# EAGLE design error (EAGLE 6.6.0)
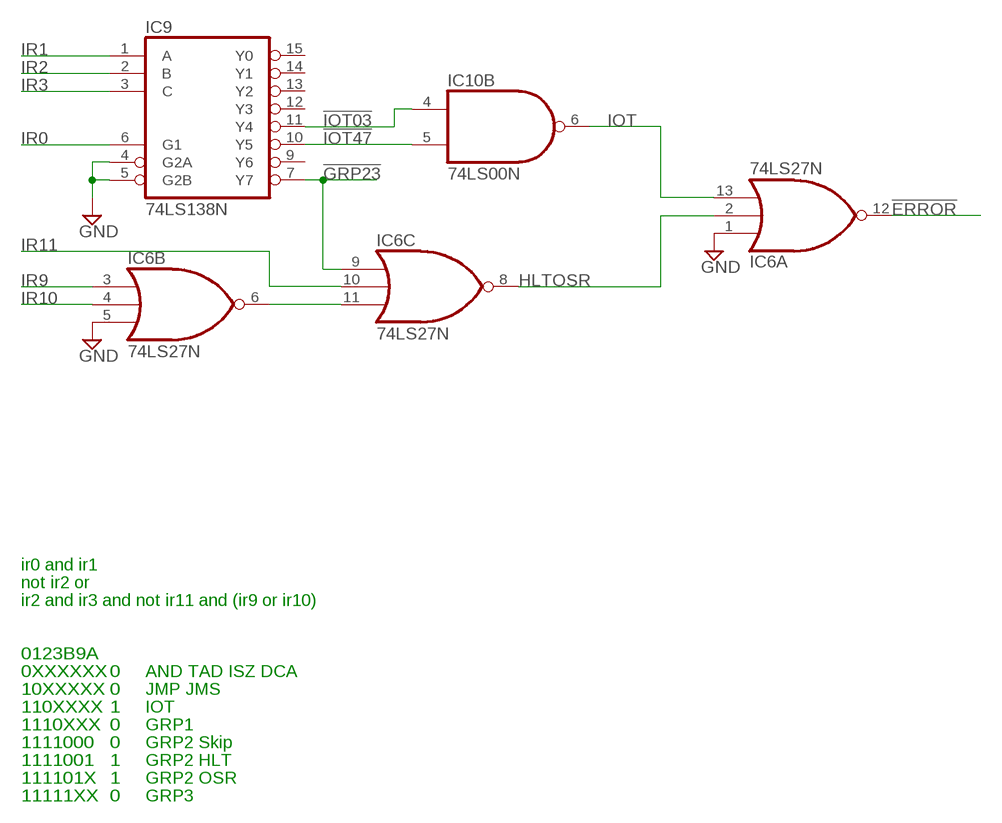
[diagram p0: schematic, sheet 1]

## Parts
IC6  74LS27N  [DIL14]
IC9  74LS138N  [DIL16]
IC10  74LS00N  [DIL14]

## Nets
!ERROR: IC6.12(A:O)
!GRP23: IC6.9(C:I0) IC9.7(Y7)
!IOT03: IC9.11(Y4) IC10.4(B:I0)
!IOT47: IC9.10(Y5) IC10.5(B:I1)
GND: IC6.1(A:I0) IC6.5(B:I2) IC9.4(G2A) IC9.5(G2B)
HLTOSR: IC6.2(A:I1) IC6.8(C:O)
IOT: IC6.13(A:I2) IC10.6(B:O)
IR0: IC9.6(G1)
IR1: IC9.1(A)
IR2: IC9.2(B)
IR3: IC9.3(C)
IR9: IC6.3(B:I0)
IR10: IC6.4(B:I1)
IR11: IC6.10(C:I1)
N$14: IC6.6(B:O) IC6.11(C:I2)
Unconnected: IC9.9(Y6) IC9.12(Y3) IC9.13(Y2) IC9.14(Y1) IC9.15(Y0) IC10.1(A:I0) IC10.2(A:I1) IC10.3(A:O) IC10.8(C:O) IC10.9(C:I0) IC10.10(C:I1) IC10.11(D:O) IC10.12(D:I0) IC10.13(D:I1)

## Notes on the sheet
- ir0 and ir1
- not ir2 or
- ir2 and ir3 and not ir11 and (ir9 or ir10)
- 0123B9A
- 0XXXXXX | 0 | AND TAD ISZ DCA
- 10XXXXX | 0 | JMP JMS
- 110XXXX | 1 | IOT
- 1110XXX | 0 | GRP1
- 1111000 | 0 | GRP2 Skip
- 1111001 | 1 | GRP2 HLT
- 111101X | 1 | GRP2 OSR
- 11111XX | 0 | GRP3

## Power pins joined to a net without a drawn wire
GND: IC6.7(P:GND) IC9.8(GND) IC10.7(P:GND)
VCC: IC6.14(P:VCC) IC9.16(VCC) IC10.14(P:VCC)

## Library data of the parts
IC6 = 74xx-us:74*27: Triple 3-input NOR gate
IC9 = 74xx-us:74*138: 3-line to 8-line DECODER/DEMULTIPLEXER
IC10 = 74xx-us:74*00: Quad 2-input NAND gate

## Board
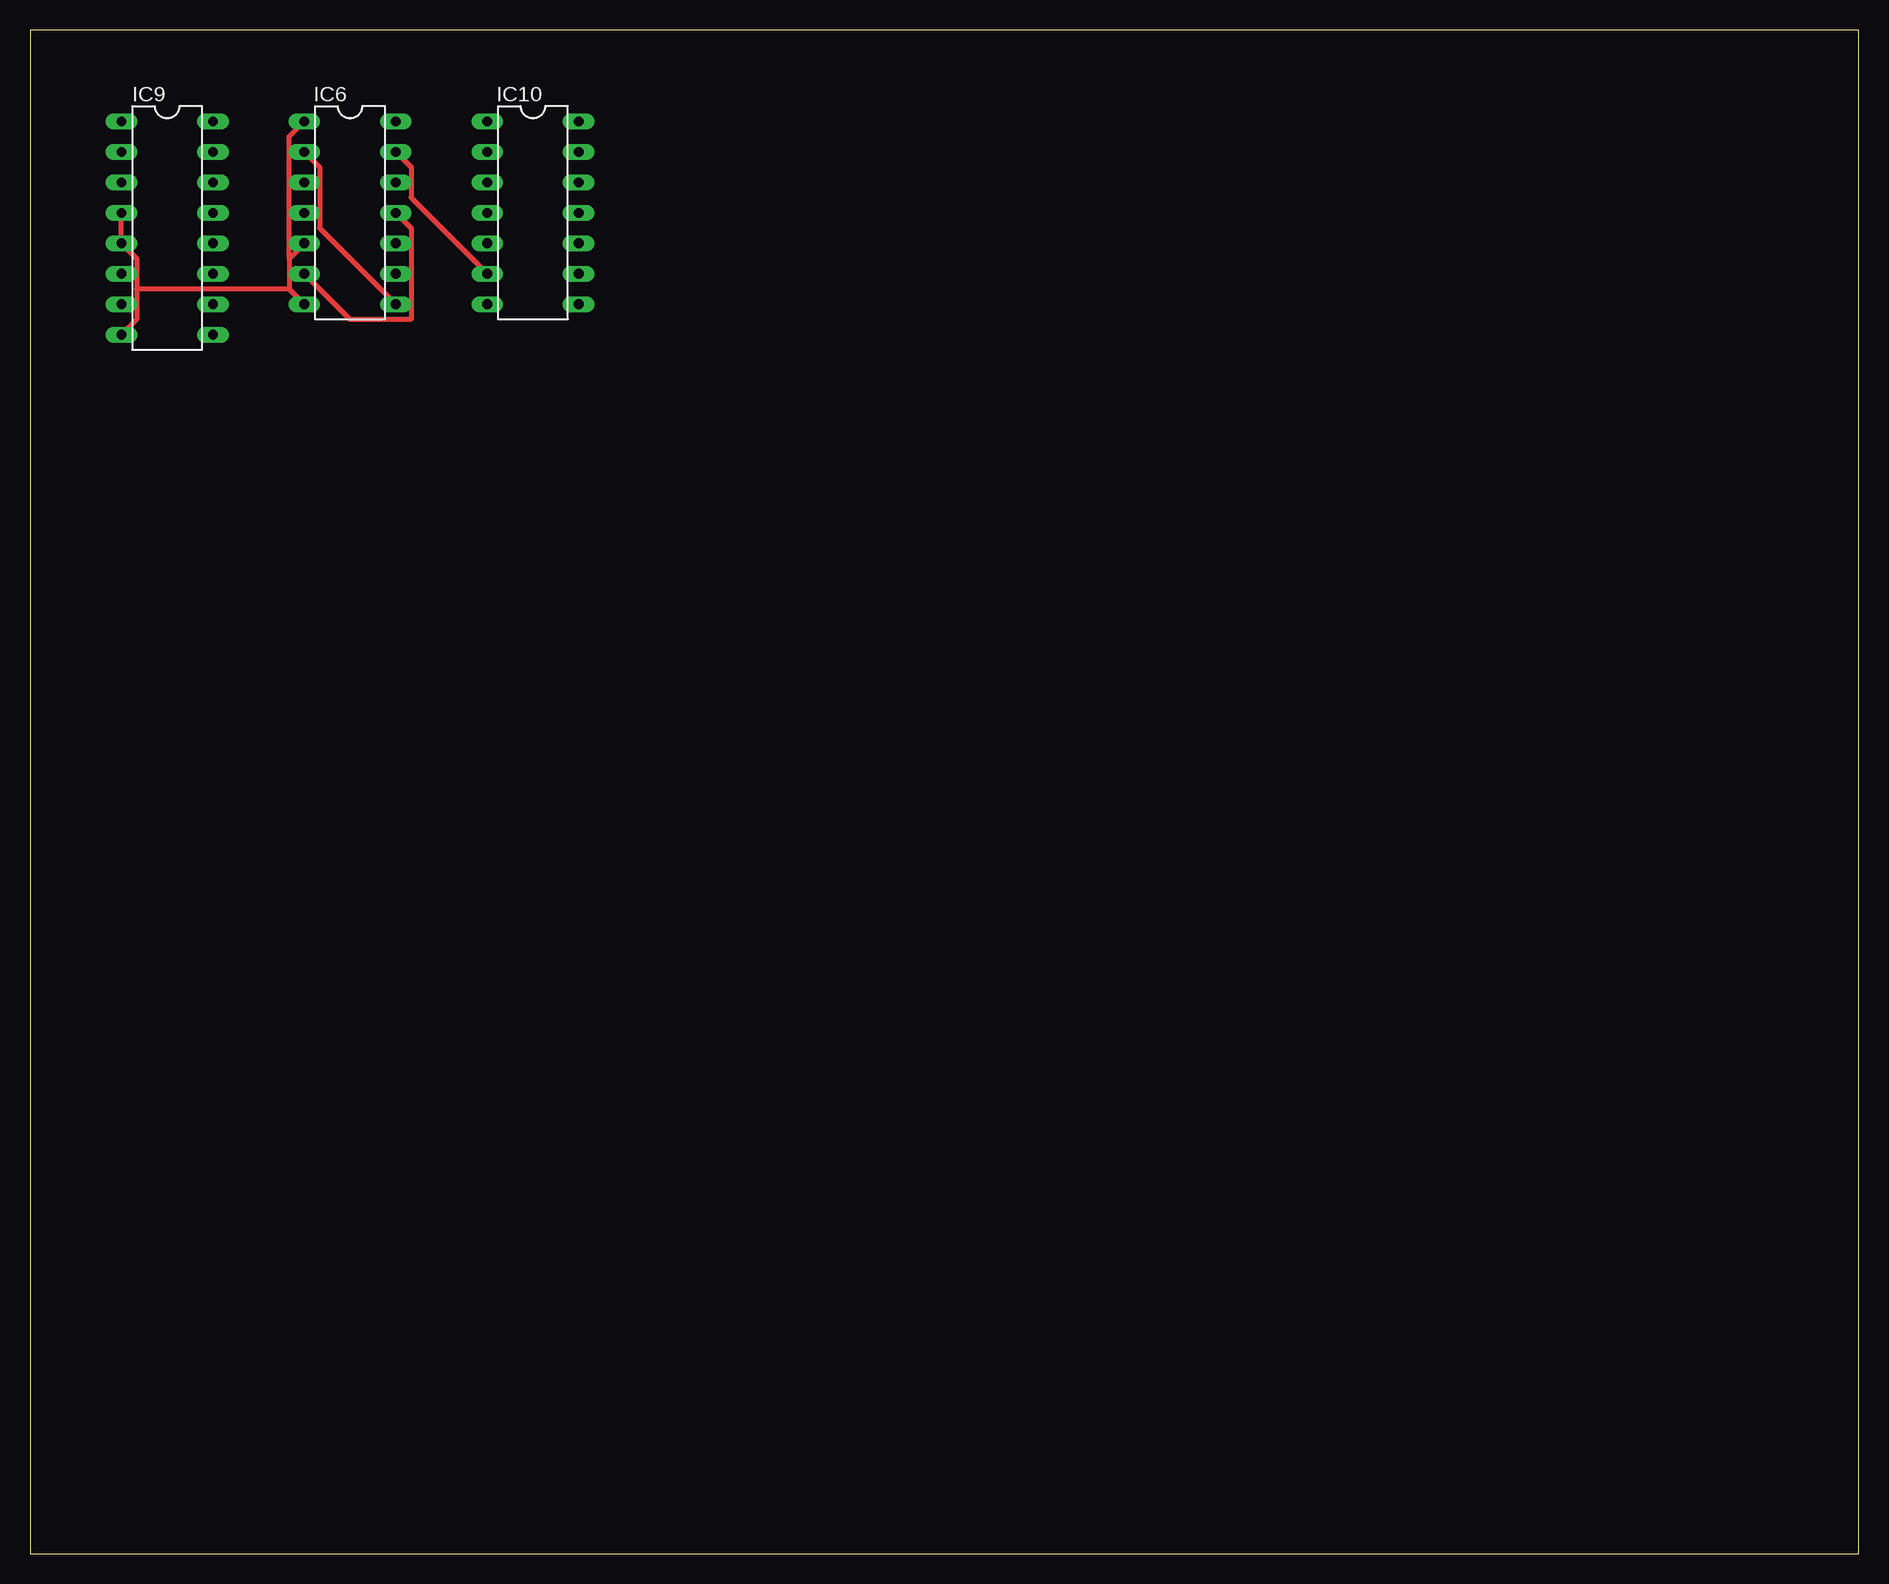
[diagram p1: board, top side]
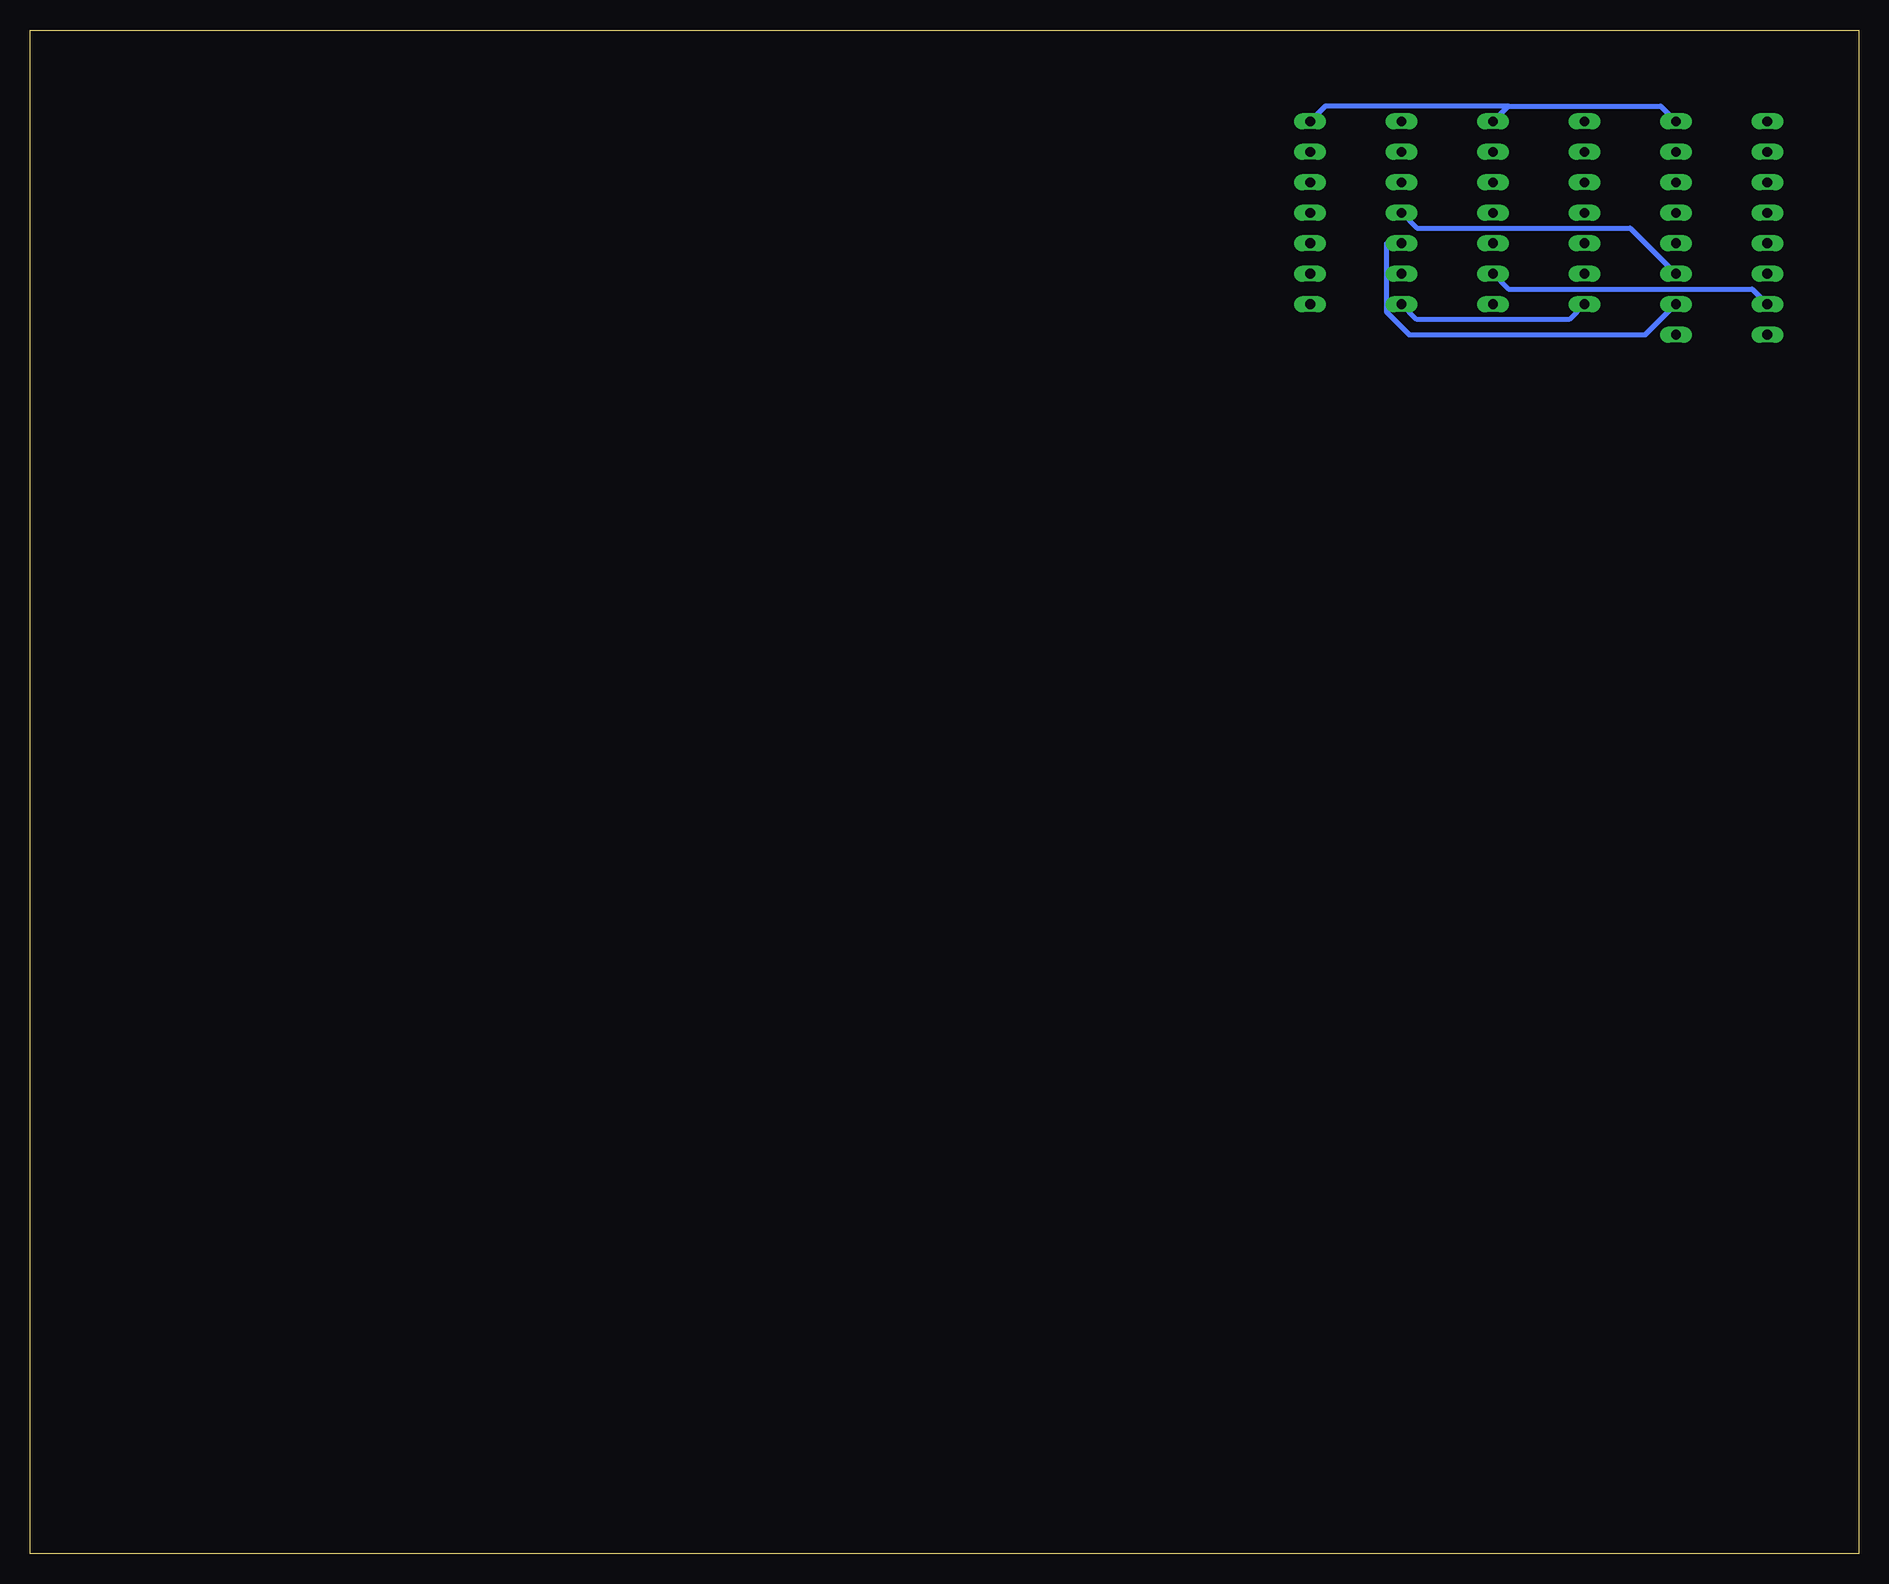
[diagram p2: board, bottom side, seen from below]

Size 152.4 x 127 mm. Coordinates in mm from the lower left corner, seen from the top.
Outline: 0,0 152.4,0 152.4,127 0,127 0,0
Copper layers (1+16): Top 0.035mm / dielectric 1.5mm / Bottom 0.035mm
Design rules "16mils": minimum track width 16mil, minimum drill 32mil, track to track 15mil, track to pad 10mil, pad to pad 10mil, via to via 10mil, smd to smd 10mil, copper to edge 13mil, drill to drill 10mil, minimum pad ring 10mil, minimum via ring 8mil, stop-mask expansion 0mil, vias tented up to drill 0mil, thermal gap 10mil

### Footprints (pad centres in the part's own frame; a part is rotated, then mirrored left to right if it is on the bottom)
DIL14 = drill 0.813 long: 1 -7.62,-3.81; 2 -5.08,-3.81; 3 -2.54,-3.81; 4 0,-3.81; 5 2.54,-3.81; 6 5.08,-3.81; 7 7.62,-3.81; 8 7.62,3.81; 9 5.08,3.81; 10 2.54,3.81; 11 0,3.81; 12 -2.54,3.81; 13 -5.08,3.81; 14 -7.62,3.81
DIL16 = drill 0.813 long: 1 -8.89,-3.81; 2 -6.35,-3.81; 3 -3.81,-3.81; 4 -1.27,-3.81; 5 1.27,-3.81; 6 3.81,-3.81; 7 6.35,-3.81; 8 8.89,-3.81; 9 8.89,3.81; 10 6.35,3.81; 11 3.81,3.81; 12 1.27,3.81; 13 -1.27,3.81; 14 -3.81,3.81; 15 -6.35,3.81; 16 -8.89,3.81

### Placement (x,y rotation side)
IC6  26.67,111.76 270 top
IC9  11.43,110.49 270 top
IC10  41.91,111.76 270 top

### Tracks (layer width: path | path; a pad name or v marks a point on that pad's centre or on a via)
!GRP23
  Bottom 0.406: IC9.7 8.89,105.41 29.21,105.41 IC6.9
!IOT03
  Bottom 0.406: IC9.11 19.05,110.49 36.83,110.49 IC10.4
!IOT47
  Bottom 0.406: IC9.10 17.78,101.6 37.47,101.6 39.37,103.5 39.37,109.22 IC10.5
GND
  Top 0.406: IC9.8 8.89,102.87 8.89,105.41 | 8.89,105.41 8.89,107.95 IC9.5 IC9.4 | 21.59,105.41 IC6.7 | 21.59,107.95 21.59,105.41 | IC6.5 21.59,107.95 | IC6.1 21.59,118.11 21.59,107.95 | 21.59,105.41 8.89,105.41
  Bottom 0.406: IC10.7 36.83,102.87 24.13,102.87 IC6.7
HLTOSR
  Top 0.406: IC6.8 24.13,110.49 24.13,115.57 IC6.2
IOT
  Top 0.406: IC10.6 31.75,113.03 31.75,115.57 IC6.13
N$14
  Top 0.406: IC6.6 26.67,102.87 31.75,102.87 31.75,110.49 IC6.11
VCC
  Bottom 0.406: IC9.16 16.51,120.65 29.21,120.65 | IC6.14 29.21,120.65 | IC10.14 44.45,120.65 29.21,120.65